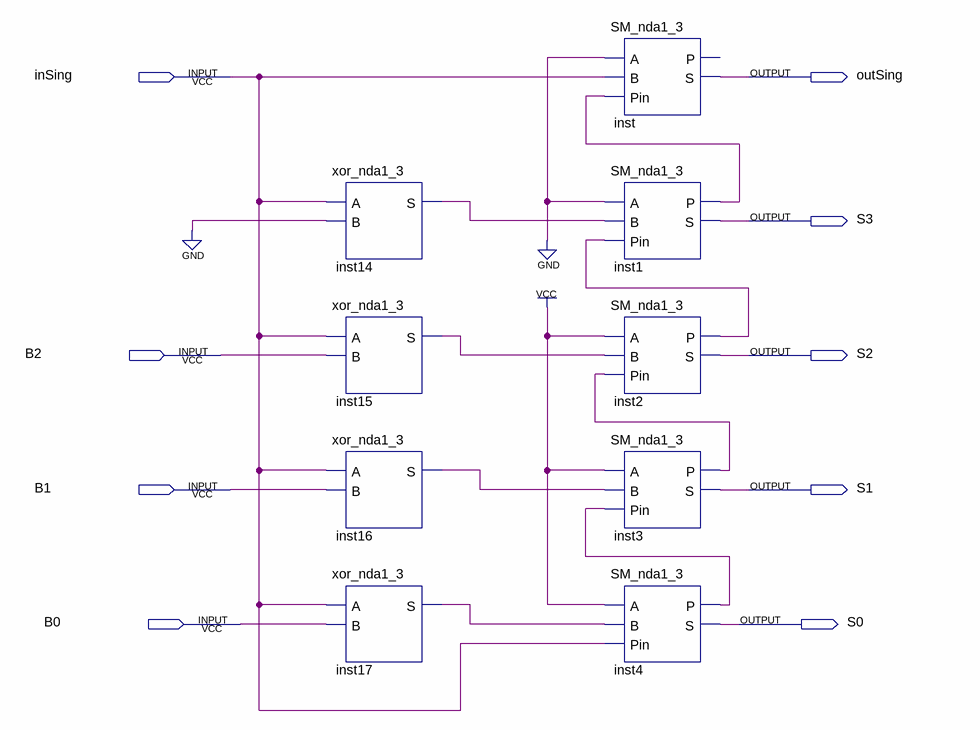
[diagram p0: schematic sheet]
// Quartus schematic ALU_nda1_3.bdf as structural Verilog: 9 symbols, 9 pins
module ALU_nda1_3 (
  input  inSing,
  input  B2,
  input  B1,
  input  B0,
  output outSing,
  output S3,
  output S2,
  output S1,
  output S0
);

  wire inst1_p, inst2_p, inst3_p, inst4_p, inst14_s, inst15_s, inst16_s, inst17_s;

  xor_nda1_3 inst14 (.A(inSing), .B(1'b0), .S(inst14_s));
  xor_nda1_3 inst15 (.A(inSing), .B(B2), .S(inst15_s));
  xor_nda1_3 inst16 (.A(inSing), .B(B1), .S(inst16_s));
  xor_nda1_3 inst17 (.A(inSing), .B(B0), .S(inst17_s));
  SM_nda1_3 inst (.A(1'b0), .B(inSing), .Pin(inst1_p), .S(outSing));  // open: P
  SM_nda1_3 inst1 (.A(1'b0), .B(inst14_s), .Pin(inst2_p), .P(inst1_p), .S(S3));
  SM_nda1_3 inst2 (.A(1'b1), .B(inst15_s), .Pin(inst3_p), .P(inst2_p), .S(S2));
  SM_nda1_3 inst3 (.A(1'b1), .B(inst16_s), .Pin(inst4_p), .P(inst3_p), .S(S1));
  SM_nda1_3 inst4 (.A(1'b1), .B(inst17_s), .Pin(inSing), .P(inst4_p), .S(S0));
endmodule
